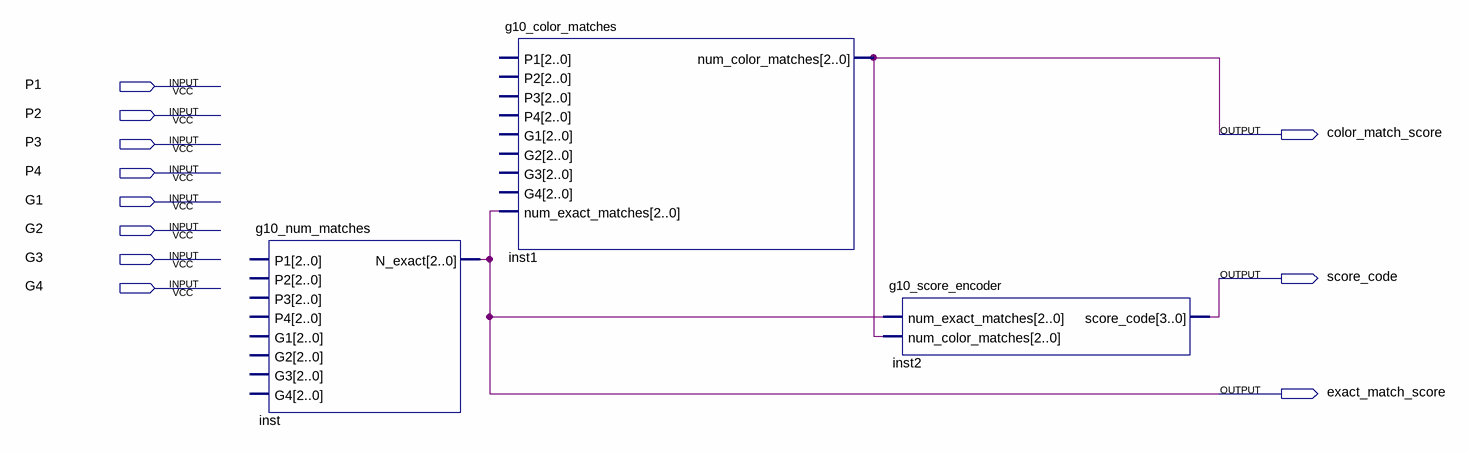
[diagram p0: schematic sheet]
// Quartus schematic g10_mastermind_score.bdf as structural Verilog: 3 symbols, 11 pins
module g10_mastermind_score (
  input  P1,
  input  P2,
  input  P3,
  input  P4,
  input  G1,
  input  G2,
  input  G3,
  input  G4,
  output color_match_score,
  output score_code,
  output exact_match_score
);

  g10_num_matches inst (.N_exact(exact_match_score));  // open: P1, P2, P3, P4, G1, G2, G3, G4
  g10_color_matches inst1 (
    .num_exact_matches({3{exact_match_score}}), .num_color_matches(color_match_score));  // open: P1, P2, P3, P4, G1, G2, G3, G4
  g10_score_encoder inst2 (
    .num_exact_matches({3{exact_match_score}}), .num_color_matches({3{color_match_score}}),
    .score_code(score_code));
endmodule
